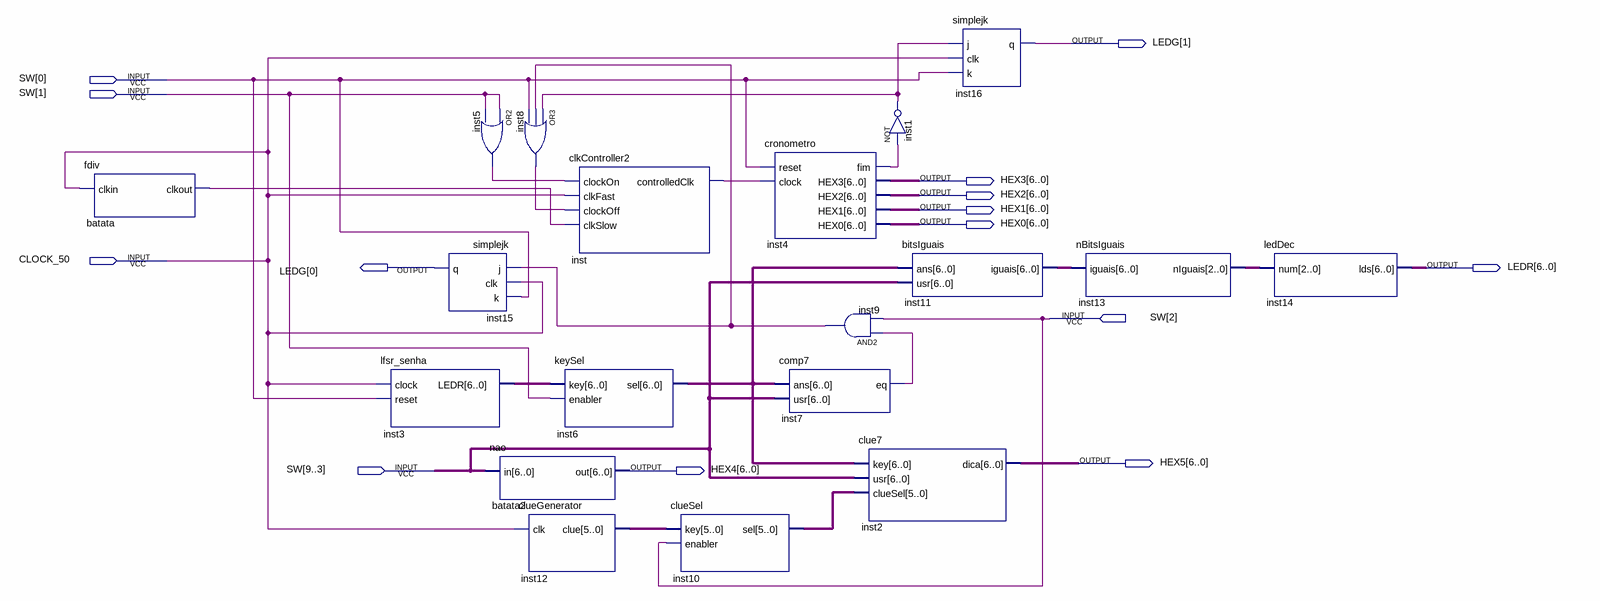
[diagram p0: schematic sheet]
// Quartus schematic ProjetoP.bdf as structural Verilog: 19 symbols, 14 pins
module ProjetoP (
  input  [9:0] SW,
  input  CLOCK_50,
  output [1:0] LEDG,
  output [6:0] HEX3,
  output [6:0] HEX2,
  output [6:0] HEX1,
  output [6:0] HEX0,
  output [6:0] LEDR,
  output [6:0] HEX5,
  output [6:0] HEX4
);

  wire batata_clkout, inst1_out, inst4_fim, inst5_out, inst7_eq, inst8_out, inst9_out, inst_controlledclk;
  wire [2:0] inst13_niguais;
  wire [5:0] inst10_sel, inst12_clue;
  wire [6:0] inst3_ledr, inst6_sel, inst11_iguais;

  fdiv batata (.clkin(CLOCK_50), .clkout(batata_clkout));
  lfsr_senha inst3 (.clock(CLOCK_50), .reset(SW[0]), .LEDR(inst3_ledr));
  or inst5 (inst5_out, SW[1], SW[1]);
  simplejk inst15 (.j(inst9_out), .clk(CLOCK_50), .k(SW[0]), .q(LEDG[0]));
  nao batata2 (.in(SW[9:3]), .out(HEX4));
  or inst8 (inst8_out, inst1_out, inst9_out, SW[0]);
  clueGenerator inst12 (.clk(CLOCK_50), .clue(inst12_clue));
  clkController2 inst (
    .clockOn(inst5_out), .clkFast(CLOCK_50), .clockOff(inst8_out), .clkSlow(batata_clkout),
    .controlledClk(inst_controlledclk));
  keySel inst6 (.key(inst3_ledr), .enabler(SW[1]), .sel(inst6_sel));
  clueSel inst10 (.key(inst12_clue), .enabler(SW[2]), .sel(inst10_sel));
  cronometro inst4 (
    .reset(SW[0]), .clock(inst_controlledclk), .fim(inst4_fim), .HEX3(HEX3), .HEX2(HEX2), .HEX1(HEX1),
    .HEX0(HEX0));
  comp7 inst7 (.ans(inst6_sel), .usr(SW[9:3]), .eq(inst7_eq));
  and inst9 (inst9_out, inst7_eq, SW[2]);
  not inst1 (inst1_out, inst4_fim);
  clue7 inst2 (.key(inst6_sel), .usr(SW[9:3]), .clueSel(inst10_sel), .dica(HEX5));
  simplejk inst16 (.j(inst1_out), .clk(CLOCK_50), .k(SW[0]), .q(LEDG[1]));
  bitsIguais inst11 (.ans(inst6_sel), .usr(SW[9:3]), .iguais(inst11_iguais));
  nBitsIguais inst13 (.iguais(inst11_iguais), .nIguais(inst13_niguais));
  ledDec inst14 (.num(inst13_niguais), .lds(LEDR));
endmodule
